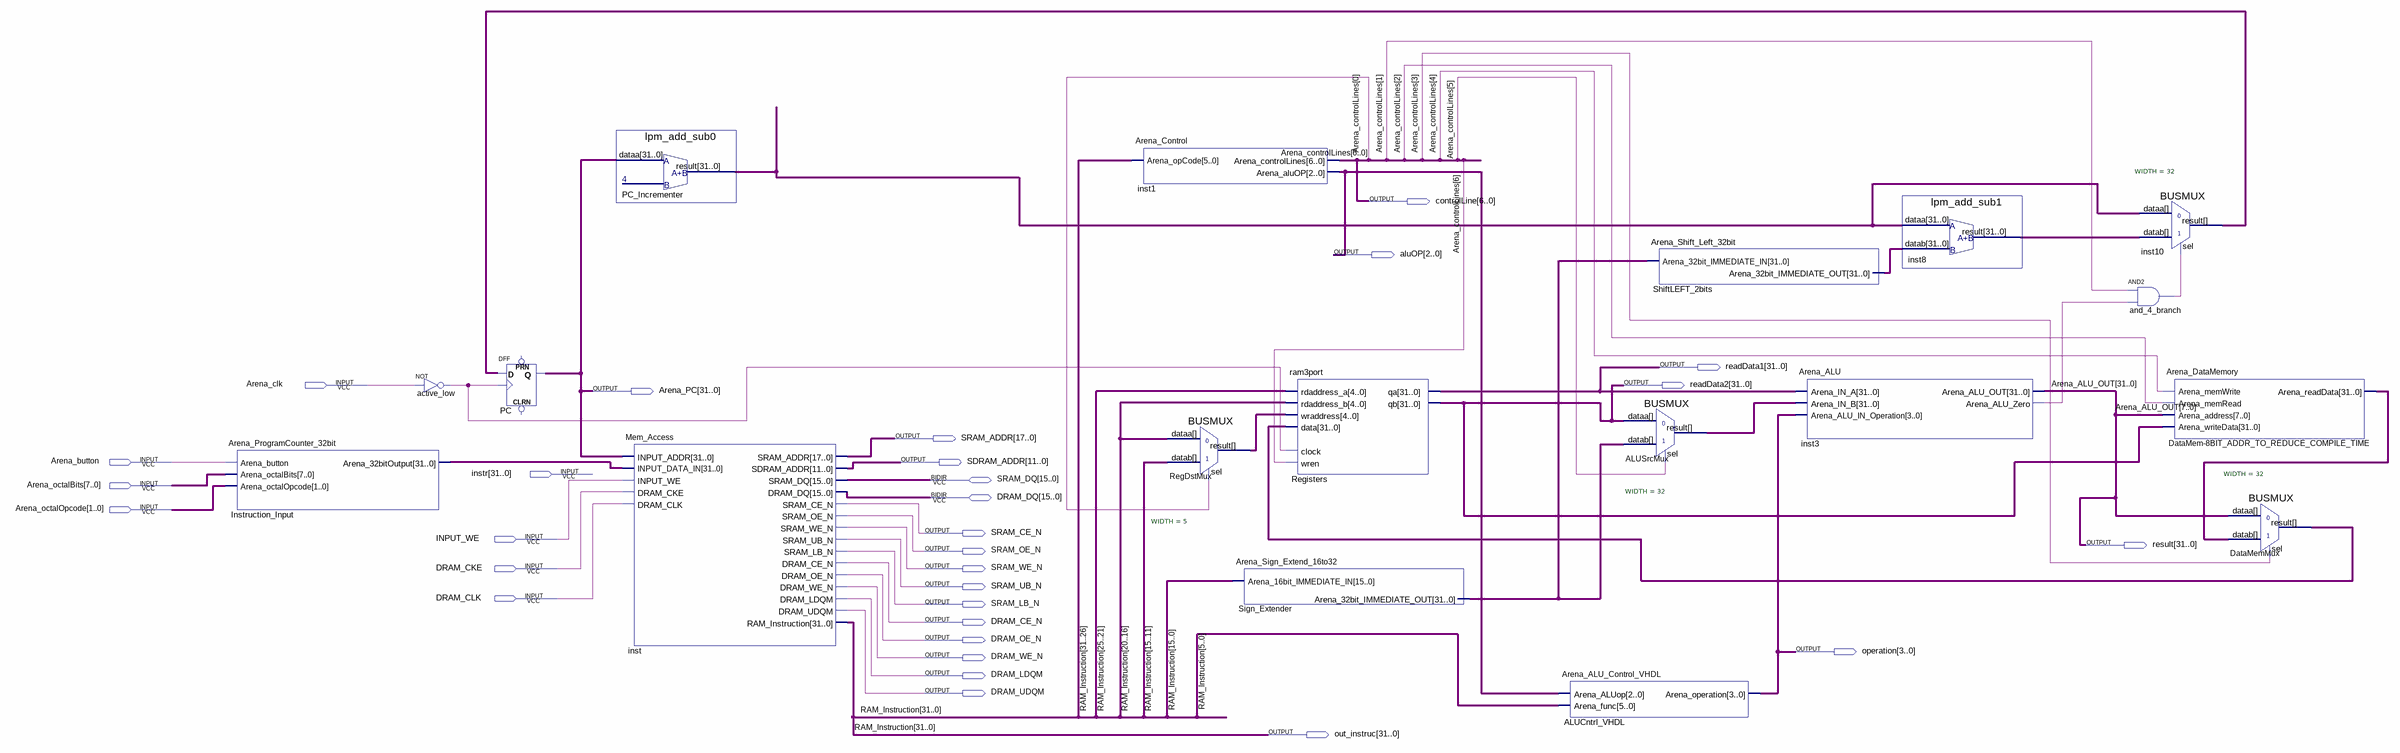
[diagram p0: schematic sheet]
// Quartus schematic Single_Cycle_CPU.bdf as structural Verilog: 18 symbols, 30 pins
module Single_Cycle_CPU (
  input  Arena_clk,
  input  Arena_button,
  input  [31:0] instr,
  input  [7:0] Arena_octalBits,
  input  [1:0] Arena_octalOpcode,
  input  INPUT_WE,
  input  DRAM_CKE,
  input  DRAM_CLK,
  inout  [15:0] SRAM_DQ,
  inout  [15:0] DRAM_DQ,
  output [6:0] controlLine,
  output [2:0] aluOP,
  output [31:0] readData1,
  output [31:0] readData2,
  output [31:0] Arena_PC,
  output [17:0] SRAM_ADDR,
  output [11:0] SDRAM_ADDR,
  output SRAM_CE_N,
  output [31:0] result,
  output SRAM_OE_N,
  output SRAM_WE_N,
  output SRAM_UB_N,
  output SRAM_LB_N,
  output DRAM_CE_N,
  output DRAM_OE_N,
  output [3:0] operation,
  output DRAM_WE_N,
  output DRAM_LDQM,
  output DRAM_UDQM,
  output [31:0] out_instruc
);

  wire active_low_out, and_4_branch_out, inst3_arena_alu_zero;
  wire [4:0] RegDstMux_result;
  wire [31:0] ALUSrcMux_result, DataMem_8BIT_ADDR_TO_REDUCE_COMPILE_TIME_arena_readdata, DataMemMux_result,
       inst8_result, inst10_result, Instruction_Input_arena_32bitoutput, PC_Incrementer_result,
       ShiftLEFT_2bits_arena_32bit_immediate_out, Sign_Extender_arena_32bit_immediate_out;

  Arena_ProgramCounter_32bit Instruction_Input (
    .Arena_button(Arena_button), .Arena_octalBits(Arena_octalBits), .Arena_octalOpcode(Arena_octalOpcode),
    .Arena_32bitOutput(Instruction_Input_arena_32bitoutput));
  not active_low (active_low_out, Arena_clk);
  DFF PC[31:0] (.CLK(active_low_out), .D(inst10_result), .Q(Arena_PC));  // open: CLRN, PRN
  lpm_add_sub0 PC_Incrementer (.dataa(Arena_PC), .result(PC_Incrementer_result));
  Mem_Access inst (
    .INPUT_ADDR(Arena_PC), .INPUT_DATA_IN(Instruction_Input_arena_32bitoutput), .INPUT_WE(INPUT_WE),
    .DRAM_CKE(DRAM_CKE), .DRAM_CLK(DRAM_CLK), .SRAM_ADDR(SRAM_ADDR), .SDRAM_ADDR(SDRAM_ADDR),
    .SRAM_CE_N(SRAM_CE_N), .SRAM_OE_N(SRAM_OE_N), .SRAM_WE_N(SRAM_WE_N), .SRAM_UB_N(SRAM_UB_N),
    .SRAM_LB_N(SRAM_LB_N), .DRAM_CE_N(DRAM_CE_N), .DRAM_OE_N(DRAM_OE_N), .DRAM_WE_N(DRAM_WE_N),
    .DRAM_LDQM(DRAM_LDQM), .DRAM_UDQM(DRAM_UDQM), .RAM_Instruction(out_instruc), .SRAM_DQ(SRAM_DQ),
    .DRAM_DQ(DRAM_DQ));
  Arena_Control inst1 (.Arena_opCode(out_instruc[31:26]), .Arena_controlLines(controlLine), .Arena_aluOP(aluOP));
  BUSMUX #(.WIDTH(5)) RegDstMux (
    .datab(out_instruc[15:11]), .sel(controlLine[0]), .dataa(out_instruc[20:16]), .result(RegDstMux_result));
  Arena_Sign_Extend_16to32 Sign_Extender (
    .Arena_16bit_IMMEDIATE_IN(out_instruc[15:0]),
    .Arena_32bit_IMMEDIATE_OUT(Sign_Extender_arena_32bit_immediate_out));
  ram3port Registers (
    .data(DataMemMux_result), .rdaddress_a(out_instruc[25:21]), .clock(active_low_out),
    .wraddress(RegDstMux_result), .wren(controlLine[6]), .rdaddress_b(out_instruc[20:16]), .qa(readData1),
    .qb(readData2));
  Arena_ALU_Control_VHDL ALUCntrl_VHDL (
    .Arena_ALUop(aluOP), .Arena_func(out_instruc[5:0]), .Arena_operation(operation));
  BUSMUX #(.WIDTH(32)) ALUSrcMux (
    .datab(Sign_Extender_arena_32bit_immediate_out), .sel(controlLine[5]), .dataa(readData2),
    .result(ALUSrcMux_result));
  Arena_Shift_Left_32bit ShiftLEFT_2bits (
    .Arena_32bit_IMMEDIATE_IN(Sign_Extender_arena_32bit_immediate_out),
    .Arena_32bit_IMMEDIATE_OUT(ShiftLEFT_2bits_arena_32bit_immediate_out));
  Arena_ALU inst3 (
    .Arena_IN_A(readData1), .Arena_IN_B(ALUSrcMux_result), .Arena_ALU_IN_Operation(operation),
    .Arena_ALU_OUT(result), .Arena_ALU_Zero(inst3_arena_alu_zero));
  lpm_add_sub1 inst8 (
    .dataa(PC_Incrementer_result), .datab(ShiftLEFT_2bits_arena_32bit_immediate_out), .result(inst8_result));
  BUSMUX #(.WIDTH(32)) inst10 (
    .datab(inst8_result), .sel(and_4_branch_out), .dataa(PC_Incrementer_result), .result(inst10_result));
  and and_4_branch (and_4_branch_out, controlLine[1], inst3_arena_alu_zero);
  Arena_DataMemory \DataMem-8BIT_ADDR_TO_REDUCE_COMPILE_TIME  (
    .Arena_memWrite(controlLine[4]), .Arena_memRead(controlLine[2]), .Arena_address(result[7:0]),
    .Arena_writeData(readData2), .Arena_readData(DataMem_8BIT_ADDR_TO_REDUCE_COMPILE_TIME_arena_readdata));
  BUSMUX #(.WIDTH(32)) DataMemMux (
    .datab(DataMem_8BIT_ADDR_TO_REDUCE_COMPILE_TIME_arena_readdata), .sel(controlLine[3]), .dataa(result),
    .result(DataMemMux_result));

  // Other names for the same wires on the sheet: Arena_ALU_OUT[31:0] = result; Arena_controlLines[6:0] = controlLine;
  //   RAM_Instruction[31:0] = out_instruc
endmodule
